# Altium schematic sheet display.SchDoc
size A4; SheetNumber: 8; SheetTotal: 8
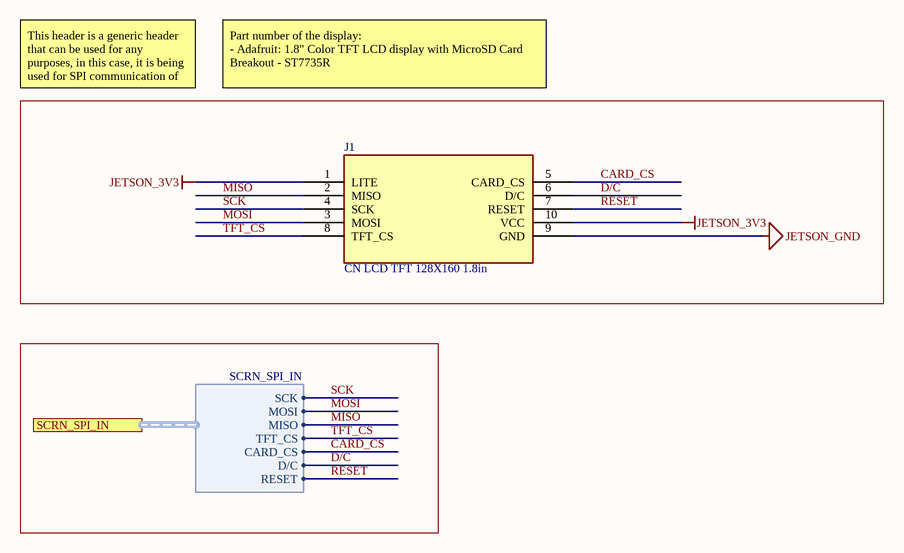
[diagram p0: display.SchDoc]

## Parts
J1  CN LCD TFT 128X160 1.8in  [CN LCD TFT 128X160 1.8in]

## Ports
SCRN_SPI_IN (harness SCRN_SPI_IN)

## Harnesses
SCRN_SPI_IN: SCK, MOSI, MISO, TFT_CS, CARD_CS, D/C, RESET

## Nets
JETSON_3V3: J1.1(LITE) J1.10(VCC)
JETSON_GND: J1.9(GND)
CARD_CS: J1.5(CARD_CS) ; port SCRN_SPI_IN.CARD_CS
D/C: J1.6(D/C) ; port SCRN_SPI_IN.D/C
MISO: J1.2(MISO) ; port SCRN_SPI_IN.MISO
MOSI: J1.3(MOSI) ; port SCRN_SPI_IN.MOSI
RESET: J1.7(RESET) ; port SCRN_SPI_IN.RESET
SCK: J1.4(SCK) ; port SCRN_SPI_IN.SCK
TFT_CS: J1.8(TFT_CS) ; port SCRN_SPI_IN.TFT_CS

## Notes on the sheet
- This header is a generic header that can be used for any purposes, in this case, it is being used for SPI communication of the display
- Part number of the display:
  - Adafruit: 1.8" Color TFT LCD display with MicroSD Card Breakout - ST7735R

## Library data of the parts
J1 = CN LCD TFT 128X160 1.8in: Graphic LCD Display Module Transmissive Red, Green, Blue (RGB) TFT - Color SPI 1.8" (45.72mm) 128 x 160; Manufacturer Part Number 1: 358; Part Number: CN LCD TFT 128X160 1.8in; Supplier 1: Digi-Key; Supplier Part Number 1: 1528-1536-ND; Supplier URL 1: https://www.digikey.ca/en/products/detail/adafruit-industries-llc/358/5801368; Pin Count: 10